# EAGLE design BusBlaster-v3a (EAGLE 5.11)
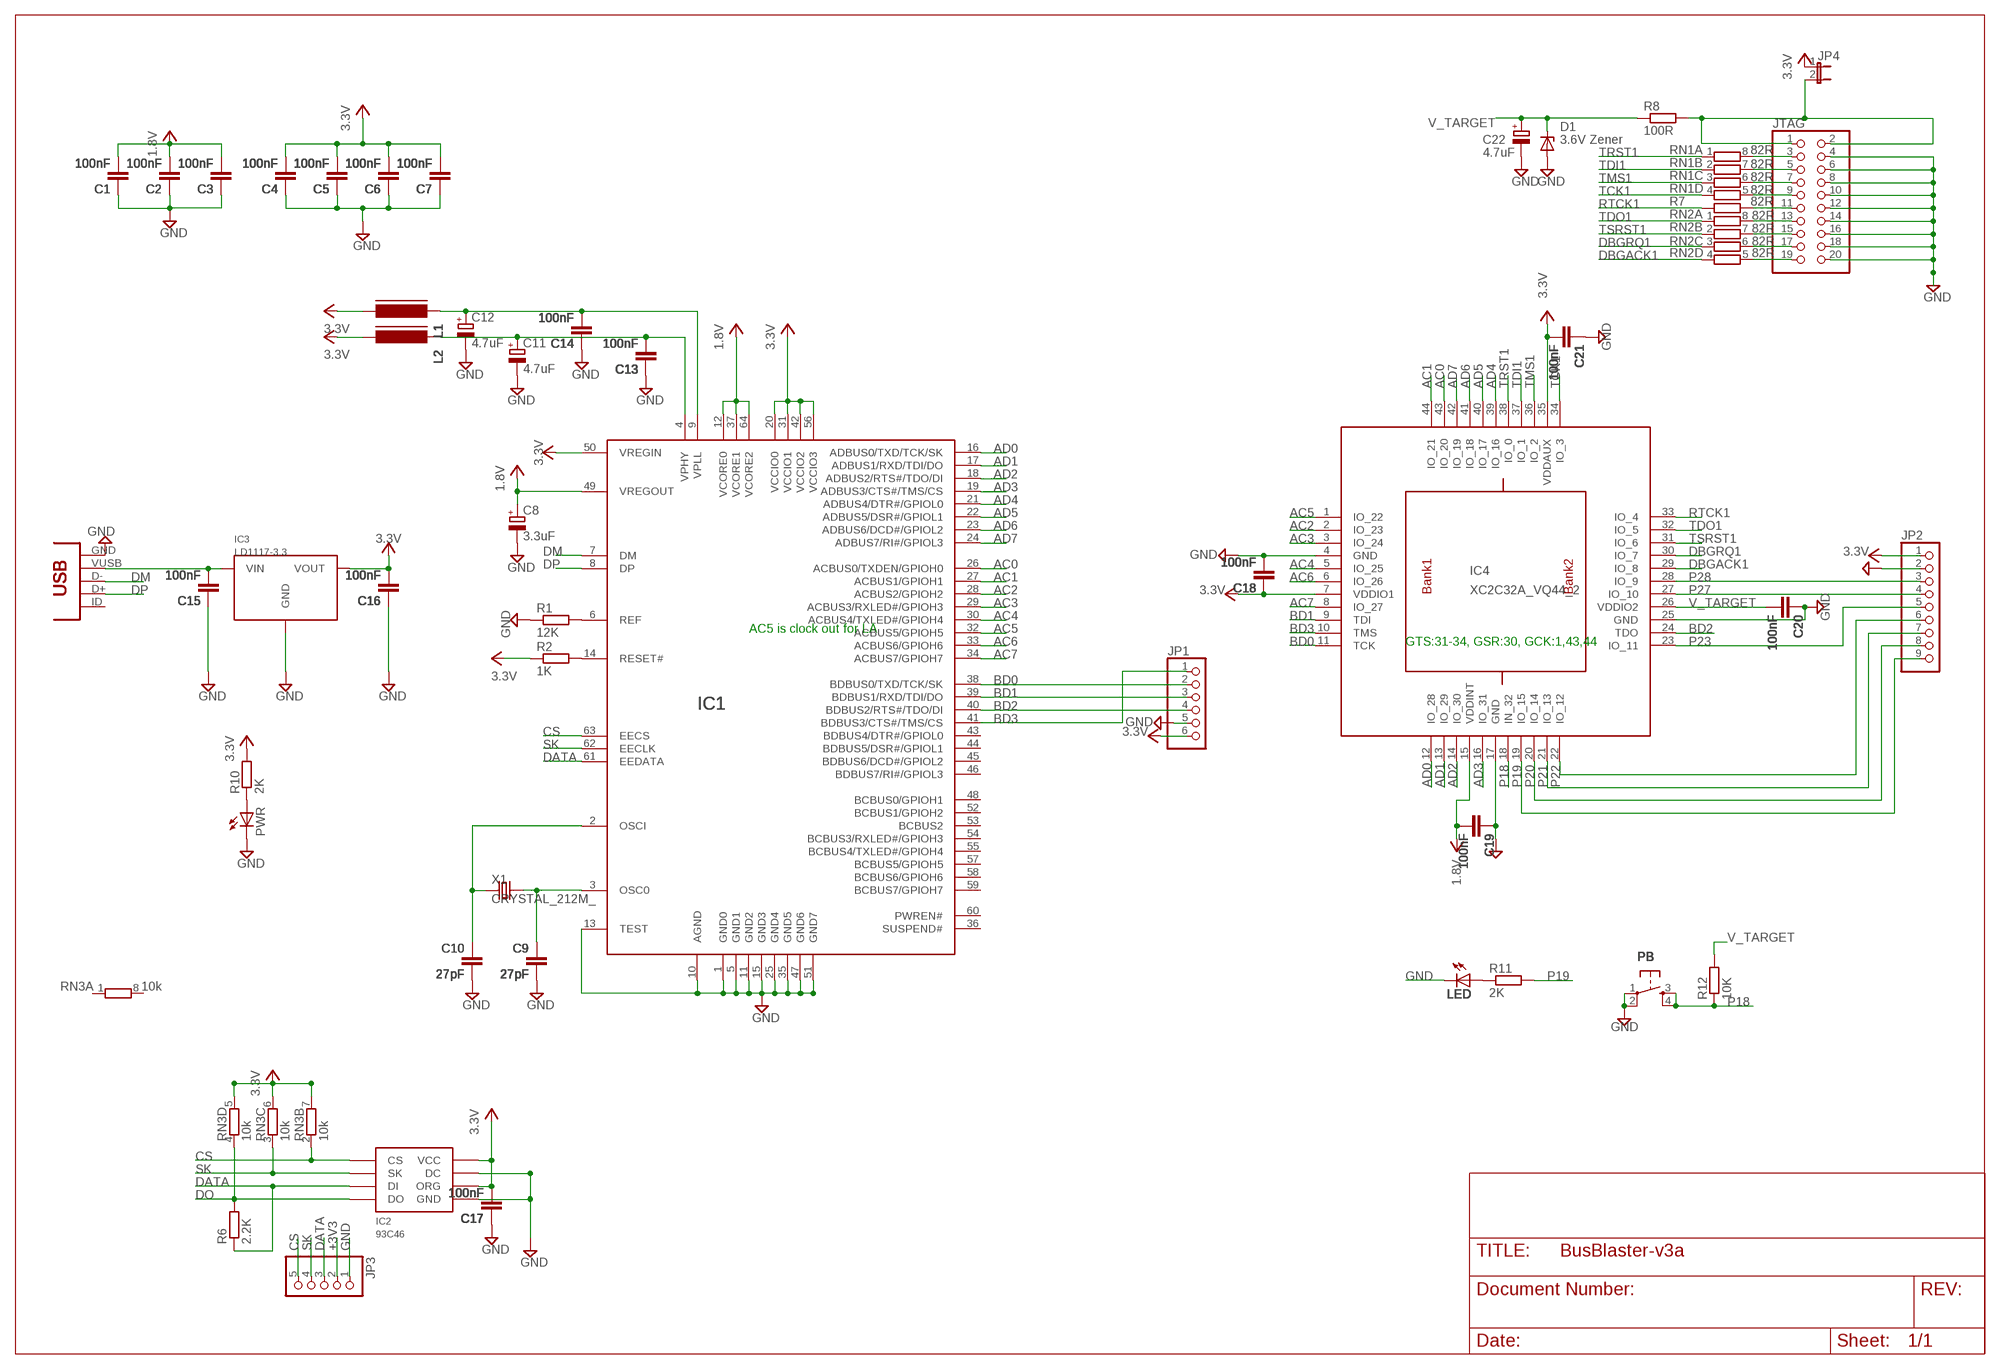
[diagram p0: schematic, sheet 1]

## Parts
C1  100nF  CAPC603  [C603]
C2  100nF  CAPC603  [C603]
C3  100nF  CAPC603  [C603]
C4  100nF  CAPC603  [C603]
C5  100nF  CAPC603  [C603]
C6  100nF  CAPC603  [C603]
C7  100nF  CAPC603  [C603]
C8  3.3uF  CAP_POLSMC_A  [SMC_A]
C9  27pF  CAPC603  [C603]
C10  27pF  CAPC603  [C603]
C11  4.7uF  CAP_POLSMC_A  [SMC_A]
C12  4.7uF  CAP_POLSMC_A  [SMC_A]
C13  100nF  CAPC603  [C603]
C14  100nF  CAPC603  [C603]
C15  100nF  CAPC603  [C603]
C16  100nF  CAPC603  [C603]
C17  100nF  CAPC603  [C603]
C18  100nF  CAPC603  [C603]
C19  100nF  CAPC603  [C603]
C20  100nF  CAPC603  [C603]
C21  100nF  CAPC603  [C603]
C22  4.7uF  CAP_POLSMC_A  [SMC_A]
D1  3.6V Zener  ZENERSOD-123  [SOD-123]
IC1  FT2232H  [LQFP64]
IC2  93C46  [SOIC8]
IC3  LD1117-3.3  [SOT223]
IC4  XC2C32A_VQ44_2  [VQ44]
JP1  PINHD-1X6  [1X06]
JP2  PINHD-1X9  [1X09]
JP3  PINHD-1X5  [1X05]
JP4  JP1EJP  [1X02]
JTAG  PINHEAD_-_COPY_PINHD-2X10SHROUDED  [PINHEAD_-_COPY_PINSHRD_PTH_2X10]
L1  FERRITE_BEAD603  [FB603]
L2  FERRITE_BEAD603  [FB603]
LED  LED805  [LED-805]
PB  SW-SMD-SMALL  [TACT_SWITCH_SMALL]
PWR  LEDCHIPLED_0805  [CHIPLED_0805]
R1  12K  RESISTORR603  [R603]
R2  1K  RESISTORR603  [R603]
R6  2.2K  RESISTORR603  [R603]
R7  82R  RESISTORR603  [R603]
R8  100R  RESISTORR1206  [R1206]
R10  2K  RESISTORR603  [R603]
R11  2K  RESISTORR603  [R603]
R12  10K  RESISTORR603  [R603]
RN1  82R  RNETWORK  [RN8P-4R-CRA06S]
RN2  82R  RNETWORK  [RN8P-4R-CRA06S]
RN3  10k  RNETWORK  [RN8P-4R-CRA06S]
USB  CON-USB-MINI-BUSB1  [CONN_USB_MINI-B]
X1  CRYSTAL_212M_  [4X6]

## Nets
1.8V: C1.2 C2.2 C3.2 C8.+ C19.2 IC1.12(VCORE0) IC1.37(VCORE1) IC1.49(VREGOUT) IC1.64(VCORE2) IC4.15(VDDINT)
+3V3: C4.2 C5.2 C6.2 C7.2 C16.2 C17.2 C18.1 C21.2 IC1.20(VCCIO0) IC1.31(VCCIO1) IC1.42(VCCIO2) IC1.50(VREGIN) IC1.56(VCCIO3) IC2.6(ORG) IC2.8(VCC) IC3.2(VOUT) IC4.7(VDDIO1) IC4.35(VDDAUX) JP1.6 JP2.1 JP3.2 JP4.1 L1.2 L2.2 R2.1 R10.2 RN3.5 RN3.6 RN3.7 ; supply symbol labelled 3.3V
AC0: IC1.26(ACBUS0/TXDEN/GPIOH0) IC4.43(IO_20)
AC1: IC1.27(ACBUS1/GPIOH1) IC4.44(IO_21)
AC2: IC1.28(ACBUS2/GPIOH2) IC4.2(IO_23)
AC3: IC1.29(ACBUS3/RXLED#/GPIOH3) IC4.3(IO_24)
AC4: IC1.30(ACBUS4/TXLED#/GPIOH4) IC4.5(IO_25)
AC5: IC1.32(ACBUS5/GPIOH5) IC4.1(IO_22)
AC6: IC1.33(ACBUS6/GPIOH6) IC4.6(IO_26)
AC7: IC1.34(ACBUS7/GPIOH7) IC4.8(IO_27)
AD0: IC1.16(ADBUS0/TXD/TCK/SK) IC4.12(IO_28)
AD1: IC1.17(ADBUS1/RXD/TDI/DO) IC4.13(IO_29)
AD2: IC1.18(ADBUS2/RTS#/TDO/DI) IC4.14(IO_30)
AD3: IC1.19(ADBUS3/CTS#/TMS/CS) IC4.16(IO_31)
AD4: IC1.21(ADBUS4/DTR#/GPIOL0) IC4.39(IO_16)
AD5: IC1.22(ADBUS5/DSR#/GPIOL1) IC4.40(IO_17)
AD6: IC1.23(ADBUS6/DCD#/GPIOL2) IC4.41(IO_18)
AD7: IC1.24(ADBUS7/RI#/GPIOL3) IC4.42(IO_19)
BD0: IC1.38(BDBUS0/TXD/TCK/SK) IC4.11(TCK) JP1.2
BD1: IC1.39(BDBUS1/RXD/TDI/DO) IC4.9(TDI) JP1.3
BD2: IC1.40(BDBUS2/RTS#/TDO/DI) IC4.24(TDO) JP1.4
BD3: IC1.41(BDBUS3/CTS#/TMS/CS) IC4.10(TMS) JP1.1
CS: IC1.63(EECS) IC2.1(CS) JP3.5 RN3.2
DATA: IC1.61(EEDATA) IC2.3(DI) JP3.3 R6.1
DBGACK1: IC4.29(IO_8) RN2.4
DBGRQ1: IC4.30(IO_7) RN2.3
DM: IC1.7(DM) USB.D-
DO: IC2.4(DO) R6.2 RN3.4
DP: IC1.8(DP) USB.D+
GND: C1.1 C2.1 C3.1 C4.1 C5.1 C6.1 C7.1 C8.- C9.2 C10.2 C11.- C12.- C13.1 C14.1 C15.1 C16.1 C17.1 C18.2 C19.1 C20.1 C21.1 C22.- D1.A IC1.1(GND0) IC1.5(GND1) IC1.10(AGND) IC1.11(GND2) IC1.13(TEST) IC1.15(GND3) IC1.25(GND4) IC1.35(GND5) IC1.47(GND6) IC1.51(GND7) IC2.5(GND) IC2.7(DC) IC3.1(GND) IC4.4(GND) IC4.17(GND) IC4.25(GND) JP1.5 JP2.2 JP3.1 JTAG.4 JTAG.6 JTAG.8 JTAG.10 JTAG.12 JTAG.14 JTAG.16 JTAG.18 JTAG.20 LED.C PB.1 PB.2 PWR.C R1.1 USB.GND
N$1: C9.1 IC1.3(OSC0) X1.2(X2)
N$2: C10.1 IC1.2(OSCI) X1.1(X1)
N$3: IC1.14(RESET#) R2.2
N$4: IC1.6(REF) R1.2
N$5: C15.2 IC3.3(VIN) USB.VUSB
N$6: PWR.A R10.1
N$7: JTAG.3 RN1.8
N$8: LED.A R11.1
N$9: JTAG.5 RN1.7
N$10: JTAG.7 RN1.6
N$11: JTAG.9 RN1.5
N$12: JTAG.11 R7.2
N$13: JTAG.13 RN2.8
N$14: JTAG.15 RN2.7
N$15: JTAG.17 RN2.6
N$16: JTAG.19 RN2.5
P18: IC4.18(IN_32) PB.3 PB.4 R12.1
P19: IC4.19(IO_15) JP2.9 R11.2
P20: IC4.20(IO_14) JP2.8
P21: IC4.21(IO_13) JP2.7
P22: IC4.22(IO_12) JP2.6
P23: IC4.23(IO_11) JP2.5
P27: IC4.27(IO_10) JP2.4
P28: IC4.28(IO_9) JP2.3
RTCK1: IC4.33(IO_4) R7.1
SK: IC1.62(EECLK) IC2.2(SK) JP3.4 RN3.3
TCK1: IC4.34(IO_3) RN1.4
TDI1: IC4.37(IO_1) RN1.2
TDO1: IC4.32(IO_5) RN2.1
TMS1: IC4.36(IO_2) RN1.3
TRST1: IC4.38(IO_0) RN1.1
TSRST1: IC4.31(IO_6) RN2.2
V_TARGET: C20.2 C22.+ D1.C IC4.26(VDDIO2) R8.1 R12.2
V_TARGET_UNREG: JP4.2 JTAG.1 JTAG.2 R8.2
VPHY: C11.+ C13.2 IC1.4(VPHY) L2.1
VPLL: C12.+ C14.2 IC1.9(VPLL) L1.1
Unconnected: IC1.36(SUSPEND#) IC1.43(BDBUS4/DTR#/GPIOL0) IC1.44(BDBUS5/DSR#/GPIOL1) IC1.45(BDBUS6/DCD#/GPIOL2) IC1.46(BDBUS7/RI#/GPIOL3) IC1.48(BCBUS0/GPIOH1) IC1.52(BCBUS1/GPIOH2) IC1.53(BCBUS2) IC1.54(BCBUS3/RXLED#/GPIOH3) IC1.55(BCBUS4/TXLED#/GPIOH4) IC1.57(BCBUS5/GPIOH5) IC1.58(BCBUS6/GPIOH6) IC1.59(BCBUS7/GPIOH7) IC1.60(PWREN#) RN3.1 RN3.8 USB.BODY@1(BODY) USB.BODY@2(BODY) USB.BODY@3(BODY) USB.BODY@4(BODY) USB.ID(USBID)

## Notes on the sheet
- AC5 is clock out for LA
- GTS:31-34, GSR:30, GCK:1,43,44

## Library data of the parts
C1-C7 C9 C10 C13-C21 = dp_devices:CAP
C8 C11 C12 C22 = DP-EagleLibrary:CAP_POL
D1 = dp_devices:ZENER: Zener Diode SOD-323
IC1 = dp_devices:FT2232H: DUAL HIGH SPEED USB TO MULTIPURPOSE UART/FIFO IC
IC2 = DP-EagleLibrary:93C46
IC3 = DP-EagleLibrary:LD1117-3.3
IC4 = dp_devices:XC2C32A_VQ44_2: xc2c32a_vq44-ian edit this description Auto generated by make-symbol-device-package-bsdl.ulp Rev. 29 Source: xc2c32a_vq44-ian.bsd
JP1 = pinhead:PINHD-1X6: PIN HEADER
JP2 = pinhead - Copy:PINHD-1X9: PIN HEADER
JP3 = pinhead:PINHD-1X5: PIN HEADER
JP4 = jumper:JP1E: JUMPER
JTAG = LPC1768board:PINHEAD_-_COPY_PINHD-2X10: PIN HEADER
L1 L2 = dp_devices:FERRITE_BEAD
LED = dp_devices:LED
PB = dp_devices:SW-SMD-SMALL
PWR = led:LED: LED OSRAM: - CHIPLED LG R971, LG N971, LY N971, LG Q971, LY Q971, LO R971, LY R971 LH N974, LH R974 LS Q976, LO Q976, LY Q976 LO Q996 - Hyper CHIPLED LW Q18S LB Q993, LB Q99A, LB R99A - SideLED LS A670, LO A670, LY A670, LG A670, LP A670 LB A673, LV A673, LT A673, LW A673 LH A674 LY A675 LS A676, LA A676, LO A676, LY A676, LW A676 LS A679, LY A679, LG A679 - Hyper Micro SIDELED® LS Y876, LA Y876, LO Y876, LY Y876 LT Y87S - SmartLED LW L88C, LW L88S LB L89C, LB L89S, LG L890 LS L89K, LO L89K, LY L89K LS L896, LA L896, LO L896, LY L896 - TOPLED LS T670, LO T670, LY T670, LG T670, LP T670 LSG T670, LSP T670, LSY T670, LOP T670, LYG T670 LG T671, LOG T671, LSG T671 LB T673, LV T673, LT T673, LW T673 LH T674 LS T676, LA T676, LO T676, LY T676, LB T676, LH T676, LSB T676, LW T676 LB T67C, LV T67C, LT T67C, LS T67K, LO T67K, LY T67K, LW E67C LS E67B, LA E67B, LO E67B, LY E67B, LB E67C, LV E67C, LT E67C LW T67C LS T679, LY T679, LG T679 LS T770, LO T770, LY T770, LG T770, LP T770 LB T773, LV T773, LT T773, LW T773 LH T774 LS E675, LA E675, LY E675, LS T675 LS T776, LA T776, LO T776, LY T776, LB T776 LHGB T686 LT T68C, LB T68C - Hyper Mini TOPLED® LB M676 - Mini TOPLED Santana® LG M470 LS M47K, LO M47K, LY M47K Source: http://www.osram.convergy.de LUXEON: - LUMILED® LXK2-PW12-R00, LXK2-PW12-S00, LXK2-PW14-U00, LXK2-PW14-V00 LXK2-PM12-R00, LXK2-PM12-S00, LXK2-PM14-U00 LXK2-PE12-Q00, LXK2-PE12-R00, LXK2-PE12-S00, LXK2-PE14-T00, LXK2-PE14-U00 LXK2-PB12-K00, LXK2-PB12-L00, LXK2-PB12-M00, LXK2-PB14-N00, LXK2-PB14-P00, LXK2-PB14-Q00 LXK2-PR12-L00, LXK2-PR12-M00, LXK2-PR14-Q00, LXK2-PR14-R00 LXK2-PD12-Q00, LXK2-PD12-R00, LXK2-PD12-S00 LXK2-PH12-R00, LXK2-PH12-S00 LXK2-PL12-P00, LXK2-PL12-Q00, LXK2-PL12-R00 Source: www.luxeon.com KINGBRIGHT: KA-3528ASYC Source: www.kingbright.com
R1 R2 R6-R8 R10-R12 = dp_devices:RESISTOR
RN1-RN3 = dp_devices:RNETWORK: 4 Resistor Array 0603
USB = dp_devices:CON-USB-MINI-B: USB connector
X1 = dp_devices:CRYSTAL_2

## Board
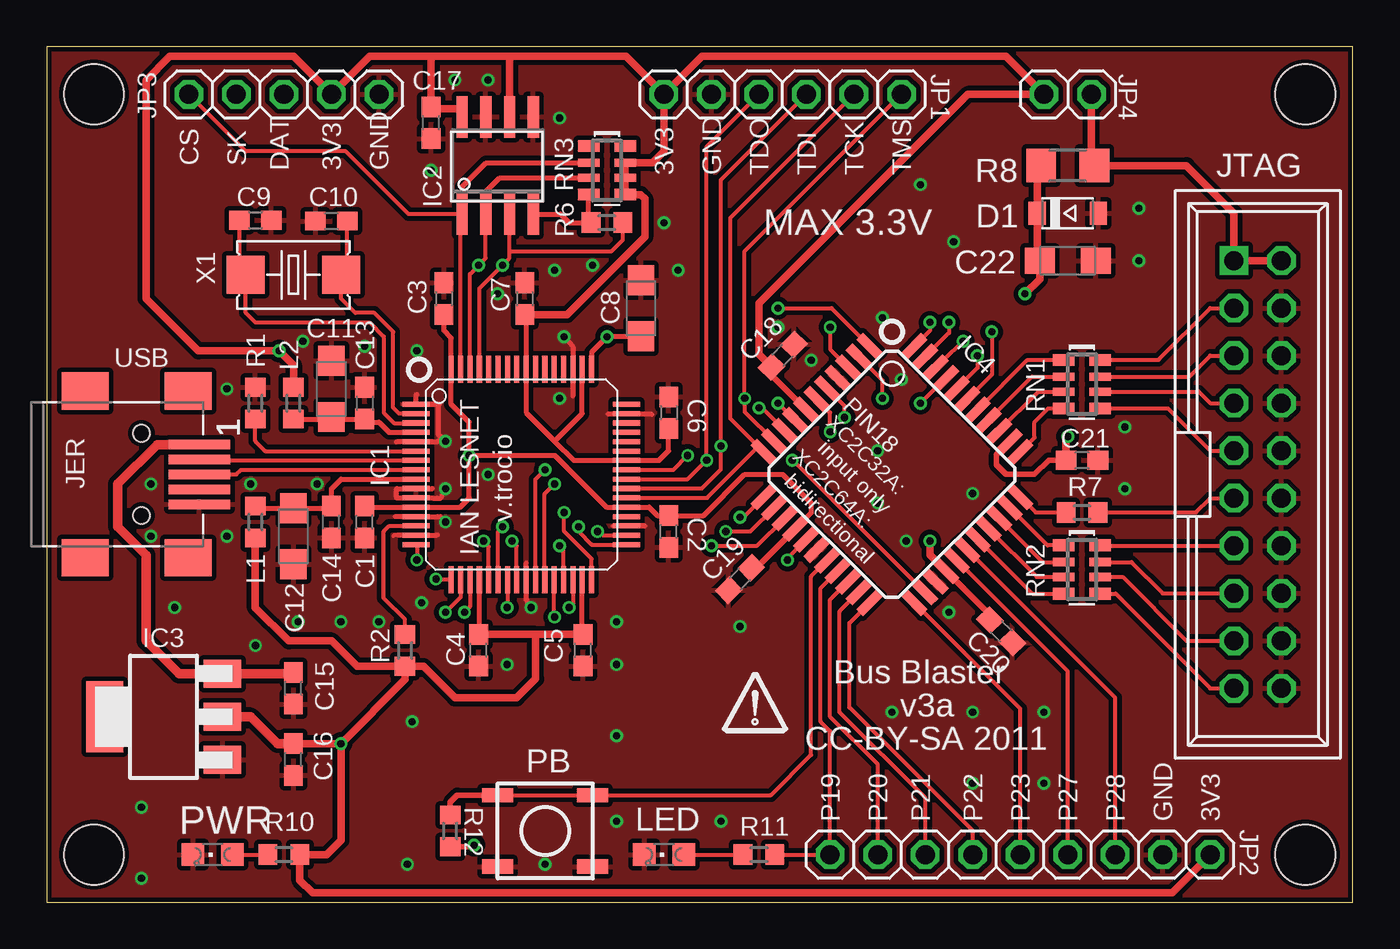
[diagram p1: board, top side]
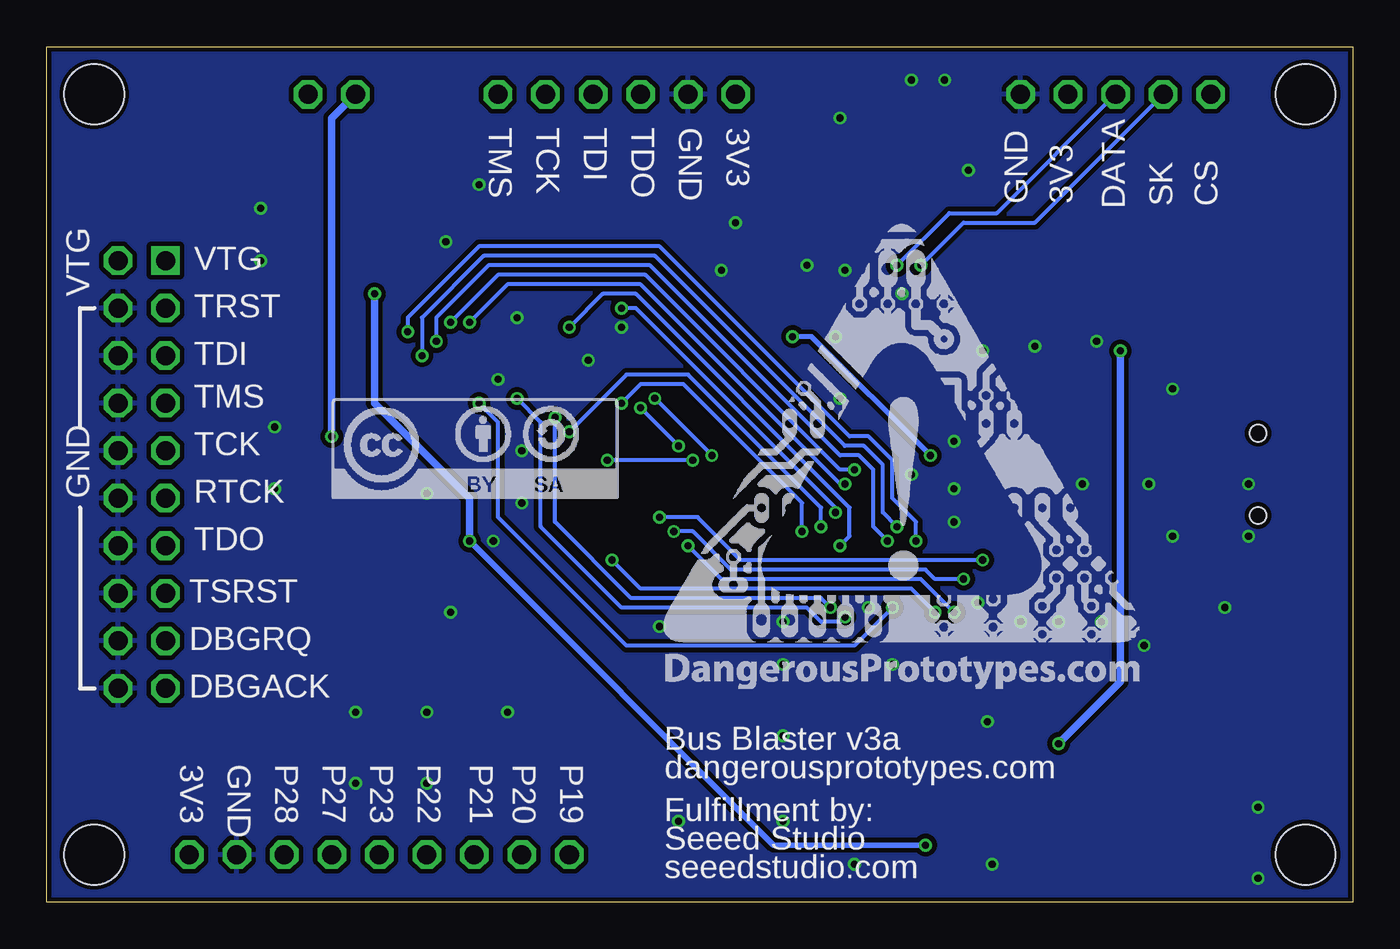
[diagram p2: board, bottom side, seen from below]

Size 69.83 x 45.72 mm. Coordinates in mm from the lower left corner, seen from the top.
Outline: 69.83,0 69.83,45.72 0,45.72 0,0 69.83,0
Copper layers (1*16): Top 0.035mm / dielectric 1.5mm / Bottom 0.035mm
Design rules "Fusion_eagle_rule_v1.1": minimum track width 6mil, minimum drill 12mil, track to track 6mil, track to pad 6mil, pad to pad 6mil, via to via 6mil, smd to smd 0mil, copper to edge 10mil, drill to drill 10mil, minimum pad ring 10mil, minimum via ring 6mil, stop-mask expansion 2mil, vias tented up to drill 100mil, thermal gap 10mil
Holes 3.2 mm at 67.29,2.54 2.52,2.54 2.52,43.18 67.29,43.18

### Footprints (pad centres in the part's own frame; a part is rotated, then mirrored left to right if it is on the bottom)
C603 = smd 1.1 x 1: 1 -0.85,0; 2 0.85,0
SMC_A = smd 1.6 x 1.4: + -1.5,0; - 1.5,0
SOD-123 = smd 0.91 x 1.22: A 1.635,0; C -1.635,0
LQFP64 = smd 1.45 x 0.27: 1 -5.625,3.75; 2 -5.625,3.25; 3 -5.625,2.75; 4 -5.625,2.25; 5 -5.625,1.75; 6 -5.625,1.25; 7 -5.625,0.75; 8 -5.625,0.25; 9 -5.625,-0.25; 10 -5.625,-0.75; 11 -5.625,-1.25; 12 -5.625,-1.75; 13 -5.625,-2.25; 14 -5.625,-2.75; 15 -5.625,-3.25; 16 -5.625,-3.75; 33 5.625,-3.75; 34 5.625,-3.25; 35 5.625,-2.75; 36 5.625,-2.25; 37 5.625,-1.75; 38 5.625,-1.25; 39 5.625,-0.75; 40 5.625,-0.25; 41 5.625,0.25; 42 5.625,0.75; 43 5.625,1.25; 44 5.625,1.75; 45 5.625,2.25; 46 5.625,2.75; 47 5.625,3.25; 48 5.625,3.75 | smd 0.27 x 1.45: 17 -3.75,-5.625; 18 -3.25,-5.625; 19 -2.75,-5.625; 20 -2.25,-5.625; 21 -1.75,-5.625; 22 -1.25,-5.625; 23 -0.75,-5.625; 24 -0.25,-5.625; 25 0.25,-5.625; 26 0.75,-5.625; 27 1.25,-5.625; 28 1.75,-5.625; 29 2.25,-5.625; 30 2.75,-5.625; 31 3.25,-5.625; 32 3.75,-5.625; 49 3.75,5.625; 50 3.25,5.625; 51 2.75,5.625; 52 2.25,5.625; 53 1.75,5.625; 54 1.25,5.625; 55 0.75,5.625; 56 0.25,5.625; 57 -0.25,5.625; 58 -0.75,5.625; 59 -1.25,5.625; 60 -1.75,5.625; 61 -2.25,5.625; 62 -2.75,5.625; 63 -3.25,5.625; 64 -3.75,5.625
SOIC8 = smd 0.6 x 2.2: 1 -1.905,-2.6; 2 -0.635,-2.6; 3 0.635,-2.6; 4 1.905,-2.6; 5 1.905,2.6; 6 0.635,2.6; 7 -0.635,2.6; 8 -1.905,2.6
SOT223 = smd 1.5 x 2: 1 -2.3,-3.15; 2 0,-3.15; 3 2.3,-3.15 | smd 3.8 x 2: 4 0,3.15
VQ44 = smd 1.5 x 0.5: 1 -5.7,4; 2 -5.7,3.2; 3 -5.7,2.4; 4 -5.7,1.6; 5 -5.7,0.8; 6 -5.7,0; 7 -5.7,-0.8; 8 -5.7,-1.6; 9 -5.7,-2.4; 10 -5.7,-3.2; 11 -5.7,-4; 23 5.7,-4; 24 5.7,-3.2; 25 5.7,-2.4; 26 5.7,-1.6; 27 5.7,-0.8; 28 5.7,0; 29 5.7,0.8; 30 5.7,1.6; 31 5.7,2.4; 32 5.7,3.2; 33 5.7,4 | smd 0.5 x 1.5: 12 -4,-5.7; 13 -3.2,-5.7; 14 -2.4,-5.7; 15 -1.6,-5.7; 16 -0.8,-5.7; 17 0,-5.7; 18 0.8,-5.7; 19 1.6,-5.7; 20 2.4,-5.7; 21 3.2,-5.7; 22 4,-5.7; 34 4,5.7; 35 3.2,5.7; 36 2.4,5.7; 37 1.6,5.7; 38 0.8,5.7; 39 0,5.7; 40 -0.8,5.7; 41 -1.6,5.7; 42 -2.4,5.7; 43 -3.2,5.7; 44 -4,5.7
1X06 = drill 1.016 octagon: 1 -6.35,0; 2 -3.81,0; 3 -1.27,0; 4 1.27,0; 5 3.81,0; 6 6.35,0
1X09 = drill 1.016 octagon: 1 -10.16,0; 2 -7.62,0; 3 -5.08,0; 4 -2.54,0; 5 0,0; 6 2.54,0; 7 5.08,0; 8 7.62,0; 9 10.16,0
1X05 = drill 1.016 octagon: 1 -5.08,0; 2 -2.54,0; 3 0,0; 4 2.54,0; 5 5.08,0
1X02 = drill 1.016 octagon: 1 -1.27,0; 2 1.27,0
PINHEAD_-_COPY_PINSHRD_PTH_2X10 = drill 1.016 square: 1 -11.43,-1.27 | drill 1.016 octagon: 2 -11.43,1.27; 3 -8.89,-1.27; 4 -8.89,1.27; 5 -6.35,-1.27; 6 -6.35,1.27; 7 -3.81,-1.27; 8 -3.81,1.27; 9 -1.27,-1.27; 10 -1.27,1.27; 11 1.27,-1.27; 12 1.27,1.27; 13 3.81,-1.27; 14 3.81,1.27; 15 6.35,-1.27; 16 6.35,1.27; 17 8.89,-1.27; 18 8.89,1.27; 19 11.43,-1.27; 20 11.43,1.27
FB603 = smd 1 x 1.1: 1 -0.85,0; 2 0.85,0
LED-805 = smd 1.2 x 1.2: A 0,-1.05; C 0,1.05
TACT_SWITCH_SMALL = smd 1.651 x 0.762: 1 -2.54,1.905; 2 2.54,1.905; 3 -2.54,-1.905; 4 2.54,-1.905
CHIPLED_0805 = smd 1.2 x 1.2: A 0,-1.05; C 0,1.05
R603 = smd 1 x 1.1: 1 -0.85,0; 2 0.85,0
R1206 = smd 1.6 x 1.803: 1 -1.422,0; 2 1.422,0
RN8P-4R-CRA06S = smd 0.63 x 1.15: 1 -1.295,-0.975; 4 1.295,-0.975; 5 1.295,0.975; 8 -1.295,0.975 | smd 0.44 x 1.15: 2 -0.4,-0.975; 3 0.4,-0.975; 6 0.4,0.975; 7 -0.4,0.975
CONN_USB_MINI-B = smd 2 x 2.5: BODY@1 -4.45,2.5; BODY@2 4.45,2.5; BODY@3 4.45,-3; BODY@4 -4.45,-3 | smd 0.5 x 3.3: D+ 0,3.1; D- -0.8,3.1; GND 1.6,3.1; ID 0.8,3.1; VUSB -1.6,3.1 | hole 0.9: -2.2,0; 2.2,0
4X6@1 = smd 2.032 x 2.032: 1 -2.54,0; 2 2.54,0

### Placement (x,y rotation side)
C1  17,20.32 90 top
C2  33.25,19.82 90 top
C3  21.24,32.26 270 top
C4  23.09,13.46 90 top
C5  28.68,13.46 90 top
C6  33.25,26.16 270 top
C7  25.55,32.26 270 top
C8  31.78,31.75 90 top
C9  11.16,36.45 0 top
C10  15.22,36.4 180 top
C11  15.22,27.43 90 top
C12  13.19,19.56 270 top
C13  17,26.67 270 top
C14  15.22,20.32 90 top
C15  13.19,11.43 90 top
C16  13.19,7.62 90 top
C17  20.55,41.66 90 top
C18  39.35,29.21 45 top
C19  37.06,17.27 45 top
C20  51.03,14.48 135 top
C21  55.35,23.62 180 top
C22  54.59,34.29 0 top
D1  54.59,36.83 0 top
IC1  25.38,22.86 0 top
IC2  24.11,39.37 0 top
IC3  6.25,9.91 90 top
IC4  45.19,22.86 315 top
JP1  39.35,43.18 180 top
JP2  52.05,2.54 180 top
JP3  12.68,43.18 180 top
JP4  54.59,43.18 0 top
JTAG  64.75,22.86 270 top
L1  11.16,20.32 270 top
L2  13.19,26.67 90 top
LED  33,2.54 90 top
PB  26.65,3.81 180 top
PWR  8.87,2.54 90 top
R1  11.16,26.67 270 top
R2  19.16,13.46 90 top
R6  29.95,36.32 180 top
R7  55.35,20.83 0 top
R8  54.59,39.37 0 top
R10  12.68,2.54 0 top
R11  38.08,2.54 0 top
R12  21.57,3.81 270 top
RN1  55.35,27.69 270 top
RN2  55.35,17.78 270 top
RN3  29.95,39.12 270 top
U$1  [DP_LOGO]  37.87,9.65 0 top
U$2  [DP_LOGO_ART_1X1]  36.81,11.43 0 bottom
U$3  [CC-BY-SA]  54.59,21.59 0 bottom
USB  5.06,22.86 270 top
X1  CRYSTAL_212M_  [4X6@1]  13.19,33.53 180 top

### Tracks (layer width: path | path; a pad name or v marks a point on that pad's centre or on a via)
1.8V  (via drill 0.38)
  Top 0.254: C1.2 17.06,21.11 IC1.12 22.11,21.11 22.59,21.59 v22.59,23.88 | C3.2 21.24,30.56 21.63,30.17 IC1.64 21.63,26.61 22.59,25.65 v22.59,23.88 | v22.59,23.88 27.16,23.88 29.92,21.11 IC1.37 32.21,21.11 32.65,20.67 C2.2 35.12,20.67 37.32,22.86 39.35,22.86 40.87,21.34 40.87,20.8 IC4.15 | C8.+ 29.98,30.25 v29.95,30.23 29.13,29.4 IC1.49
  Top 0.305: IC4.15 37.94,17.87 C19.2
  Bottom 0.254: v29.95,30.23 28.94,30.23 v22.59,23.88
+3V3  (via drill 0.38)
  Top 0.254: IC1.20 23.13,14.35 C4.2 | C7.2 25.63,31.33 IC1.56 25.63,26.17 27.16,24.64 | IC1.31 28.63,14.36 C5.2 | C6.2 33.25,24.12 32.75,23.61 IC1.42 28.19,23.61 27.16,24.64 | IC1.50 28.63,26.11 27.16,24.64
  Top 0.305: 38.75,28.8 C18.1 38.75,28.17 IC4.7 | C21.2 53.57,23.62 52.81,22.86 51.29,22.86 50.78,23.37 50.78,23.92 IC4.35
  Top 0.406: 20.55,45.21 24.87,45.21 | 24.87,45.21 30.97,45.21 JP1.6 | JP1.6 35.03,45.21 51.29,45.21 JP4.1 49.26,43.18 38.08,32 38.08,29.28 C18.1 | JP1.6 33,40.13 32.38,39.52 RN3.7 RN3.6 RN3.5 31.75,37.82 31.98,37.59 31.98,35.56 27.83,31.41 C7.2 | IC2.6 24.75,45.09 24.87,45.21 | 20.55,45.21 C17.2 20.64,42.42 22.08,42.42 22.21,42.29 IC2.8 | v15.73,8.47 C16.2 | v15.73,8.47 15.73,3.3 14.97,2.54 R10.2 13.53,1.18 14.2,0.51 60.18,0.51 JP2.1 | L1.2 11.16,15.75 12.93,13.97 15.22,13.97 16.58,12.61 R2.1 | L2.2 13.19,28.7 v12.43,29.46 8.11,29.46 5.31,32.26 5.31,43.94 6.58,45.21 13.19,45.21 JP3.2 17.25,45.21 20.55,45.21 | 26.14,14.31 C4.2 | 26.14,14.31 C5.2 | 26.14,14.31 26.14,11.94 25.13,10.92 21.82,10.92 20.14,12.61 R2.1 | R2.1 19.16,11.9 v15.73,8.47 | v54.59,24.89 54.5,24.8 C21.2
  Top 0.508: IC3.2 10.9,9.91 12.33,8.47 C16.2
  Bottom 0.406: v12.43,29.46 12.43,11.78 v15.73,8.47 | JP4.1 54.59,41.91 v54.59,24.89
AC0  (via drill 0.38)
  Top 0.203: IC1.26 26.13,22.59 v26.65,23.11 | v48.24,30.99 48.24,30.43 IC4.43
  Bottom 0.203: v26.65,23.11 27.41,23.11 37.83,33.53 45.7,33.53 v48.24,30.99
AC1  (via drill 0.38)
  Top 0.203: IC1.27 26.63,21.82 v27.16,22.35 | v47.22,30.99 47.22,30.55 IC4.44
  Bottom 0.203: v27.16,22.35 27.41,22.35 38.08,33.02 45.19,33.02 v47.22,30.99
AC2  (via drill 0.38)
  Top 0.203: IC1.28 27.13,15.27 v27.16,15.24 | v44.68,26.92 44.68,27.89 IC4.2
  Bottom 0.203: v27.16,15.24 27.41,14.99 28.43,14.99 29.19,15.75 39.1,15.75 43.41,20.07 43.41,25.65 v44.68,26.92
AC3  (via drill 0.38)
  Top 0.203: IC1.29 27.63,18.83 v27.41,19.05 | v41.89,30.73 41.89,29.56 IC4.3
  Bottom 0.203: v27.41,19.05 26.9,19.56 26.9,21.08 38.33,32.51 40.11,32.51 v41.89,30.73
AC4  (via drill 0.38)
  Top 0.203: IC1.30 28.13,15.96 v27.92,15.75 | v42.65,25.91 42.65,26.53 IC4.5
  Bottom 0.203: v27.92,15.75 28.43,16.26 38.59,16.26 42.65,20.32 v42.65,25.91
AC5  (via drill 0.38)
  Top 0.203: IC1.32 29.13,18.35 27.67,19.81 v27.67,20.83 | IC4.1 41.96,31.75 v39.1,31.75
  Bottom 0.203: v27.67,20.83 27.67,21.08 38.33,31.75 v39.1,31.75
AC6  (via drill 0.38)
  Top 0.203: IC1.33 29.13,19.11 28.43,19.81 v28.43,20.07 | v41.89,25.15 41.89,26.16 IC4.6
  Bottom 0.203: v28.43,20.07 28.43,21.08 35.54,28.19 38.84,28.19 v41.89,25.15
AC7  (via drill 0.38)
  Top 0.203: IC1.34 29.75,19.61 v29.44,19.81 | v39.1,26.67 40.01,25.76 IC4.8
  Bottom 0.203: v29.44,19.81 29.44,21.34 35.79,27.69 38.08,27.69 v39.1,26.67
AD0  (via drill 0.38)
  Top 0.203: v37.06,20.57 37.25,20.57 IC4.12 | v19.79,18.29 19.79,19.07 IC1.16
  Bottom 0.203: v37.06,20.57 35.03,20.57 32.75,18.29 v19.79,18.29
AD1  (via drill 0.38)
  Top 0.203: v36.3,19.81 37.62,19.81 IC4.13 | IC1.17 20.84,17.23 v20.81,17.27
  Bottom 0.203: v36.3,19.81 35.29,19.81 33.25,17.78 22.84,17.78 22.33,17.27 v20.81,17.27
AD2  (via drill 0.38)
  Top 0.203: v35.54,19.05 37.99,19.05 IC4.14 | IC1.18 22.13,16.31 v21.32,15.49
  Bottom 0.203: v21.32,15.49 23.09,17.27 33.76,17.27 v35.54,19.05
AD3  (via drill 0.38)
  Top 0.203: IC1.19 22.63,15.79 v22.33,15.49 | v39.6,18.29 39.49,18.29 IC4.16
  Bottom 0.203: v22.33,15.49 23.6,16.76 38.08,16.76 v39.6,18.29
AD4  (via drill 0.38)
  Top 0.203: IC1.21 23.63,19.02 v23.35,19.3 | v50.53,30.48 50.53,28.19 IC4.39
  Bottom 0.203: v23.35,19.3 23.35,20.32 24.62,21.59 24.62,23.62 25.89,24.89 26.9,24.89 37.06,35.05 46.72,35.05 50.53,31.24 v50.53,30.48
AD5  (via drill 0.38)
  Top 0.203: IC1.22 24.13,19.79 v24.36,20.07 | v49.76,29.21 49.76,28.56 IC4.40
  Bottom 0.203: v24.36,20.07 25.13,20.83 25.13,23.37 26.14,24.38 27.16,24.38 37.32,34.54 46.46,34.54 49.76,31.24 v49.76,29.21
AD6  (via drill 0.38)
  Top 0.203: IC1.23 v24.63,15.76 v24.62,15.75 | v46.72,26.67 48.07,28.02 IC4.41
  Bottom 0.203: v24.62,15.75 26.65,13.72 38.84,13.72 45.7,20.57 45.7,25.65 v46.72,26.67
AD7  (via drill 0.38)
  Top 0.203: IC1.24 25.13,19.05 v24.87,19.3 | 49,30.06 v49,29.97 IC4.42
  Bottom 0.203: v49,29.97 49,31.24 46.21,34.04 37.57,34.04 27.41,23.88 26.4,23.88 25.63,23.11 25.63,20.07 v24.87,19.3
BD0
  Top 0.203: JP1.2 36.56,36.58 36.56,25.84 IC4.11 38.15,24.06 37.95,24.26 | IC1.38 35.31,21.61 37.95,24.26 | 37.95,24.26 38.08,24.38
BD1  (via drill 0.38)
  Top 0.203: IC1.39 35.03,22.11 36.05,23.13 v36.05,24.38 36.05,38.61 JP1.3 | IC4.9 38.24,26.42 v38.08,26.42
  Bottom 0.203: v36.05,24.38 v38.08,26.42
BD2  (via drill 0.38)
  Top 0.203: IC1.40 34.27,22.61 v35.29,23.63 | JP1.4 35.29,40.39 v35.29,23.63 | IC4.24 39.9,23.62 v39.86,23.62 | v35.29,23.63 v35.29,23.62
  Bottom 0.203: v35.29,23.62 v39.86,23.62
BD3  (via drill 0.38)
  Top 0.203: JP1.1 37.32,34.8 v37.32,26.92 37.32,26.21 IC4.10 | IC1.41 33.5,23.11 v34.27,23.88
  Bottom 0.203: 34.22,23.88 v34.27,23.88 v37.32,26.92
CS
  Top 0.203: IC1.63 22.13,36.7 IC2.1 19.34,36.77 15.98,40.13 10.65,40.13 JP3.5
  Top 0.254: RN3.2 23.49,39.52 22.21,38.23 IC2.1
DATA  (via drill 0.38)
  Top 0.203: IC1.61 23.13,32.8 v24.36,34.04 24.75,34.42 24.75,34.8 | 24.75,34.8 IC2.3 | R6.1 30.8,35.39 30.21,34.8 24.75,34.8
  Bottom 0.203: JP3.3 19.03,36.83 21.57,36.83 v24.36,34.04
DBGACK1
  Top 0.203: IC4.29 52.7,16.48 RN2.4
DBGRQ1
  Top 0.203: IC4.30 52.93,17.38 RN2.3
DM
  Top 0.203: IC1.7 8.21,23.61 USB.D-
DO
  Top 0.254: RN3.4 28.98,36.45 R6.2 27.92,36.32 27.47,36.77 IC2.4
DP
  Top 0.203: IC1.8 10.39,23.11 10.14,22.86 USB.D+
GND  (via drill 0.38)
  Top 0.203: 25.63,16.2 25.64,16.2 | 18.78,19.61 18.58,19.61 18.52,19.56 | 25.68,16.11 25.68,15.79 v25.89,15.75
  Top 0.254: 25.63,17.78 25.63,16.2 25.63,16.16 25.68,16.11 | 25.63,17.78 25.63,18.12 | IC1.15 18.78,19.61 | 20.3,20.6 18.63,20.6 | 20.64,21.6 18.72,21.6 18.71,21.61 18.71,22.11 20.63,22.11 | 18.7,24.6 20.62,24.6 20.61,24.61 | 30.03,26.1 31.01,26.1 | 30.3,20.11 31.96,20.11 | 19.08,26.61 21,26.61 | IC1.5 20.61,24.61 | 19.79,27.14 19.75,27.11 IC1.1 20.93,26.61 20.94,26.61 20.94,24.99 21.1,24.83 20.88,24.61 20.61,24.61 | IC1.51 28.13,27.58 28.14,27.07 28.14,29.68 v27.67,30.23 | 31.01,26.1 IC1.47 | 31.01,26.1 32.31,26.1 32.35,26.07 | IC1.11 20.62,21.61 20.64,21.6 | IC1.13 20.29,20.61 20.3,20.6 | IC1.15 | 20.64,21.6 20.88,21.6 | 20.88,21.6 20.89,21.59 | 20.3,20.6 20.9,20.6 | 20.9,20.6 20.92,20.62 | IC1.15 20.87,19.61 20.88,19.63 | IC1.25 25.63,17.78 | 31.96,20.11 IC1.35 | 31.96,20.11 | 20.9,20.6 21.03,20.6 v21.32,20.32 | 20.88,21.6 21.07,21.6 v21.32,22.1
  other vias: 21.82,43.94 23.6,43.94 27.41,26.92 27.16,33.78 24.11,32.51 21.32,24.64 23.6,22.86 17,29.72 13.7,29.97 9.63,27.43 14.46,22.35 10.9,22.35 9.63,19.56 5.57,22.35 5.57,19.56 17.76,14.99 13.44,14.99 6.84,15.75 11.16,13.72 15.73,14.99 5.06,5.08 5.06,1.27 19.28,2.03 26.65,2.03 30.46,4.32 36.05,4.32 48.24,15.49 53.32,10.16 53.32,6.35 57.64,25.4 57.64,22.1 45.19,10.16 49.51,10.16 49.51,6.35 40.87,28.96 46.72,38.35 48.49,35.31 33,36.32 27.41,41.91 20.55,39.12 39.1,30.73 30.46,12.7 30.46,14.99 37.06,14.73 30.46,8.89 19.54,9.65 24.62,12.7 20.05,16 33.76,33.78 29.19,34.04 58.4,37.08 58.4,34.29 45.7,27.94 44.43,21.34 44.43,24.13 49.51,21.84 45.95,19.3 44.68,31.24 19.79,29.46
  pour Bottom (isolate 0.254): 0,0 69.83,0 69.83,45.72 0,45.72
  pour Top (isolate 0.254): 0,0 69.83,0 69.83,45.72 0,45.72
N$1
  Top 0.203: IC1.3 18.57,25.61 18.01,26.16 18.01,30.23 17.25,30.99 11.16,30.99 10.65,31.5 10.65,33.02 | 10.65,33.02 X1.2 | C9.1 10.31,33.36 10.65,33.02
N$2
  Top 0.203: IC1.2 18.83,26.11 18.52,26.42 18.52,30.48 17.51,31.5 16.49,31.5 15.73,32.26 15.73,33.02 | 15.73,33.02 X1.1 | C10.1 16.07,33.36 15.73,33.02
N$3
  Top 0.203: IC1.14 18.31,20.11 18.01,19.81 18.01,16.26 19.16,15.11 R2.2
N$4
  Top 0.203: IC1.6 11.68,24.11 11.16,24.64 R1.2
N$5
  Top 0.508: USB.VUSB 5.9,24.46 3.79,22.35 3.79,20.07 5.31,18.54 5.31,13.97 7.08,12.21 IC3.3 13.11,12.21 C15.2
N$6
  Top 0.203: PWR.A R10.1
N$7
  Top 0.203: RN1.8 59.44,28.98 62.21,31.75 JTAG.3
N$8
  Top 0.203: LED.A R11.1
N$9
  Top 0.203: RN1.7 61.09,28.09 62.21,29.21 JTAG.5
N$10
  Top 0.203: RN1.6 61.59,27.29 62.21,26.67 JTAG.7
N$11
  Top 0.203: RN1.5 59.95,26.39 62.21,24.13 JTAG.9
N$12
  Top 0.203: R7.2 61.45,20.83 62.21,21.59 JTAG.11
N$13
  Top 0.203: RN2.8 56.35,19.05 JTAG.13
N$14
  Top 0.203: RN2.7 58,18.18 59.67,16.51 JTAG.15
N$15
  Top 0.203: JTAG.17 60.94,13.97 57.53,17.38 RN2.6
N$16
  Top 0.203: RN2.5 57.15,16.48 62.21,11.43 JTAG.19
P18
  Top 0.203: PB.4 PB.3 38.71,5.71 40.87,7.87 40.87,17.41 IC4.18
  Top 0.305: PB.4 21.95,5.71 21.57,5.33 R12.1
P19
  Top 0.203: IC4.19 41.38,16.79 41.38,9.65 41.89,9.14 JP2.9 R11.2
P20
  Top 0.203: IC4.20 41.89,16.16 41.89,9.91 44.43,7.37 JP2.8
P21
  Top 0.203: IC4.21 42.4,15.54 42.4,10.16 46.97,5.59 JP2.7
P22
  Top 0.203: IC4.22 42.91,14.92 42.91,10.41 49.51,3.81 JP2.6
P23
  Top 0.203: IC4.23 52.05,10.35 JP2.5
P27
  Top 0.203: IC4.27 54.59,12.33 JP2.4
P28
  Top 0.203: IC4.28 57.13,10.92 JP2.3
RTCK1
  Top 0.203: IC4.33 52.88,20.83 R7.1
SK  (via drill 0.38)
  Top 0.203: IC1.62 22.63,33.57 v23.09,34.04 23.48,34.42 IC2.2
  Top 0.254: RN3.3 24.22,38.72 23.48,37.97 IC2.2
  Bottom 0.203: JP3.4 17,36.32 20.81,36.32 v23.09,34.04
TCK1
  Top 0.203: RN1.4 53.55,26.39 52.81,25.65 52.81,24.82 IC4.34
TDI1
  Top 0.203: RN1.2 52.68,28.09 IC4.37
TDO1
  Top 0.203: IC4.32 53.5,19.07 RN2.1
TMS1
  Top 0.203: RN1.3 53.01,27.29 IC4.36
TRST1
  Top 0.203: RN1.1 52.44,28.98 IC4.38
TSRST1
  Top 0.203: IC4.31 53.27,18.18 RN2.2
V_TARGET  (via drill 0.38)
  Top 0.305: IC4.26 50.36,15.42 C20.2 | R12.2 22.75,2.96 v22.84,3.05
  Top 0.406: R8.1 52.95,39.16 D1.C 52.95,34.42 C22.+ 53.09,33.3 v52.3,32.51 | v47.22,19.3 47.22,18.57 IC4.26
  Bottom 0.305: v22.84,3.05 30.97,3.05 v47.22,19.3
  Bottom 0.406: v52.3,32.51 52.3,26.67 47.22,21.59 v47.22,19.3
V_TARGET_UNREG
  Top 0.406: JTAG.2 JTAG.1 63.48,36.83 60.94,39.37 R8.2 55.86,39.52 JP4.2
VPHY
  Top 0.254: IC1.4 18.3,25.11 17.76,25.65 17.16,25.65 C13.2 15.33,25.82 C11.+ 15.11,25.82 L2.1
VPLL
  Top 0.254: IC1.9 15.73,22.61 15.22,22.1 C14.2 15.11,21.06 C12.+ 11.27,21.06 L1.1

### Text on the board
tNames: CS | SK | DAT | 3V3 | GND | 3V3 | GND | TDO | TDI | TCK | TMS | MAX 3.3V | JER | v.trocio | IAN LESNET | Bus Blaster | v3a | CC-BY-SA 2011 | P19 | P20 | P21 | P22 | P23 | P27 | P28 | GND | 3V3
bNames: 3V3 | GND | TDO | TDI | TCK | TMS | CS | SK | DATA | 3V3 | GND | VTG | VTG | TRST | TDI | TMS | TCK | GND | RTCK | TDO | TSRST | DBGRQ | DBGACK | Bus Blaster v3a | dangerousprototypes.com | P19 | P20 | P21 | P22 | P23 | P27 | P28 | GND | 3V3 | Fulfillment by: | Seeed Studio | seeedstudio.com